# Altium project pi_breakout.PrjPCB
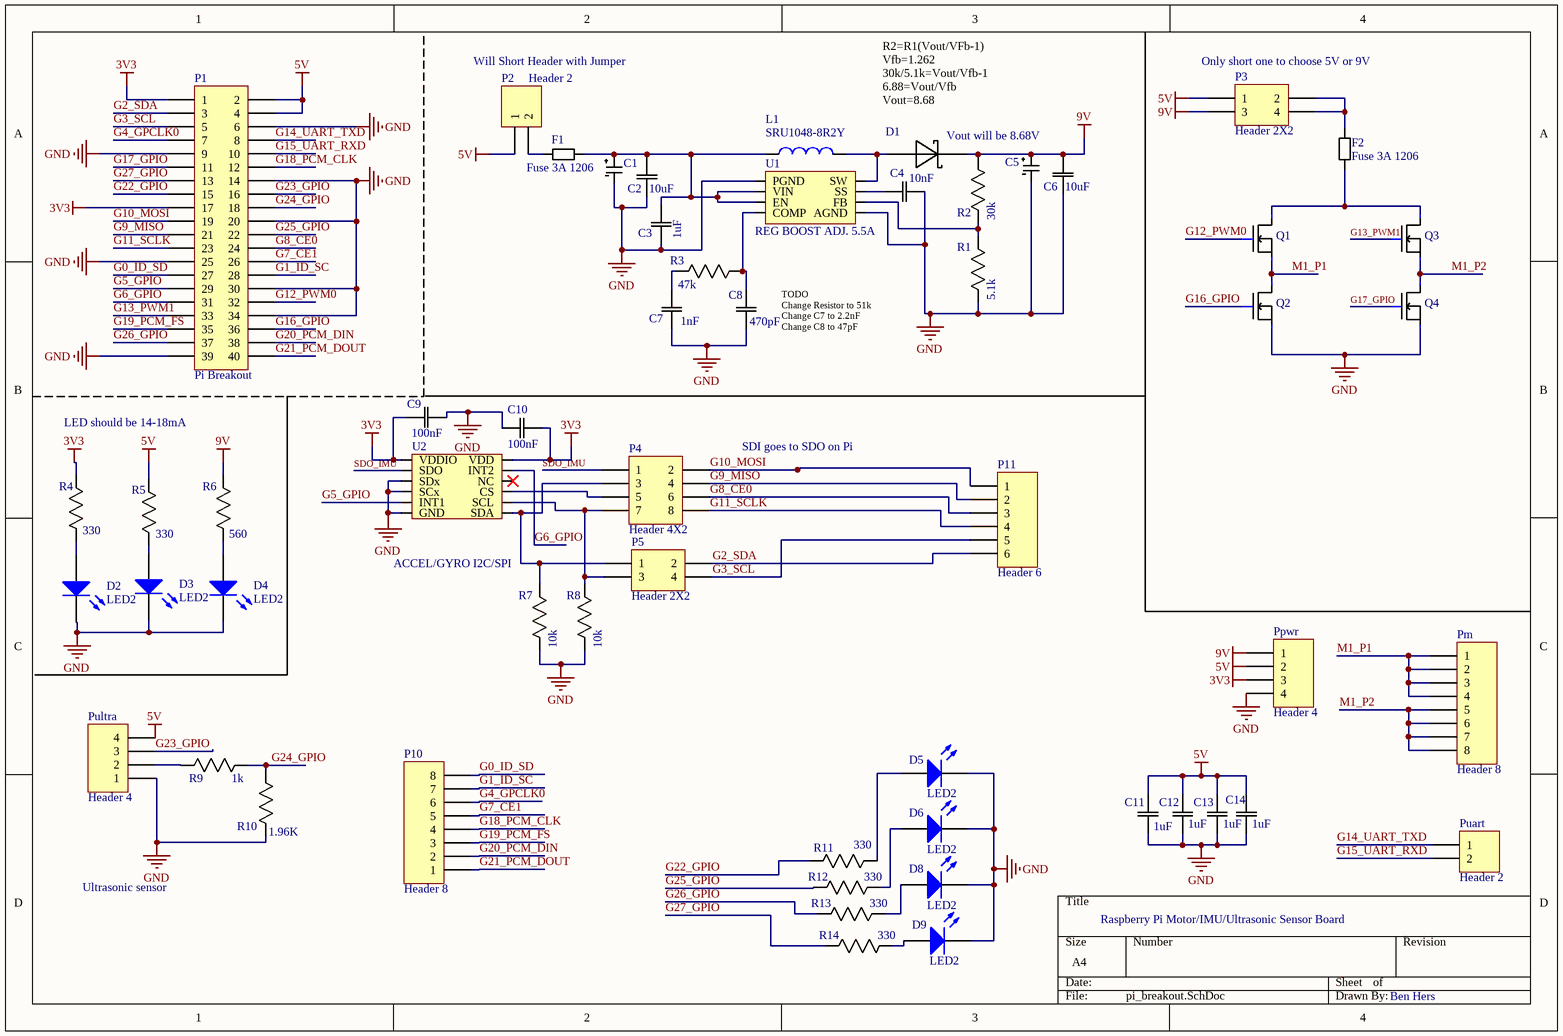
[diagram p0: pi_breakout.SchDoc]
1 sheet, 56 parts. Net scope: global (net labels, ports and power ports of the same name join across sheets).
Board file: pi_breakout.PcbDoc

## Sheet pi_breakout.SchDoc
size A4

### Parts
C1  CAP ALUM 470UF RADIAL  [Aluminum Electrolytic Capacitors Radial]  (value not drawn)
C2  10uF  [0805]
C3  1uF  [0805]
C4  10nF  [0805]
C5  CAP ALUM 470UF RADIAL  [Aluminum Electrolytic Capacitors Radial]  (value not drawn)
C6  10uF  [0805]
C7  1nF  [0805]
C8  470pF  [0805]
C9  100nF  [0805]
C10  100nF  [0805]
C11  1uF  [0805]
C12  1uF  [0805]
C13  1uF  [0805]
C14  1uF  [0805]
D1  DIODE SCHOTTKY 40V 3A SMC  [SMC]  (value not drawn)
D2  LED2  [3.2X1.6X1.1]
D3  LED2  [3.2X1.6X1.1]
D4  LED2  [3.2X1.6X1.1]
D5  LED2  [3.2X1.6X1.1]
D6  LED2  [3.2X1.6X1.1]
D8  LED2  [3.2X1.6X1.1]
D9  LED2  [3.2X1.6X1.1]
F1  Fuse 3A 1206  [1206]
F2  Fuse 3A 1206  [1206]
L1  SRU1048-8R2Y  [Inductor]
P1  Pi Breakout  [HDR2X20]
P2  Header 2  [HDR1X2]
P3  Header 2X2  [HDR2X2]
P4  Header 4X2  [HDR2X4]
P5  Header 2X2  [HDR2X2]
P10  Header 8  [HDR1X8]
P11  Header 6  [HDR1X6]
Pm  Header 8  [HDR1X8]
Ppwr  Header 4  [HDR1X4]
Puart  Header 2  [HDR1X2]
Pultra  Header 4  [HDR1X4]
Q1  N-Channel  [8-SOIC MOSFET]  (value not drawn)
Q2  N-Channel  [8-SOIC MOSFET]  (value not drawn)
Q3  N-Channel  [8-SOIC MOSFET]  (value not drawn)
Q4  N-Channel  [8-SOIC MOSFET]  (value not drawn)
R1  5.1k  [0805]
R2  30k  [0805]
R3  47k  [0805]
R4  330  [0805]
R5  330  [0805]
R6  560  [0805]
R7  10k  [0805]
R8  10k  [0805]
R9  1k  [0805]
R10  1.96K  [0805]
R11  330  [0805]
R12  330  [0805]
R13  330  [0805]
R14  330  [0805]
U1  REG BOOST ADJ. 5.5A  [ICREGBOOSTADJUSTABLE5.5A8SO]
U2  ACCEL/GYRO I2C/SPI  [IMU 14-LGA]

### Nets
3V3: C9.1(C1) C10.2(C2) P1.1 P1.17 Ppwr.3 R4.1(R1) U2.VDD U2.VDDIO
5V: C11.2(C2) C12.2(C2) C13.2(C2) C14.2(C2) P1.2 P1.4 P2.1 P3.1 Ppwr.2 Pultra.4 R5.1(R1)
9V: C5.1 C6.2(C2) D1.1(K) P3.3 Ppwr.1 R2.1(R1) R6.1(R1)
GND: C1.2 C2.1(C1) C3.1(C1) C4.2(C2) C5.2 C6.1(C1) C7.1(C1) C8.1(C1) C9.2(C2) C10.1(C1) C11.1(C1) C12.1(C1) C13.1(C1) C14.1(C1) D2.2(K) D3.2(K) D4.2(K) D5.2(K) D6.2(K) D8.2(K) D9.2(K) P1.6 P1.9 P1.14 P1.20 P1.25 P1.30 P1.34 P1.39 Ppwr.4 Pultra.1 Q2.S Q4.S R1.2(R2) R7.2(R2) R8.2(R2) R10.2(R2) U1.AGND U1.PGND U2.GND U2.SCx U2.SDx
G0_ID_SD: P1.27 P10.8
G1_ID_SC: P1.28 P10.7
G2_SDA: P1.3 P5.2 P11.6
G3_SCL: P1.5 P5.4 P11.5
G4_GPCLK0: P1.7 P10.6
G5_GPIO: P1.29 U2.INT1
G6_GPIO: P1.31 U2.INT2
G7_CE1: P1.26 P10.5
G8_CE0: P1.24 P4.6 P11.3
G9_MISO: P1.21 P4.4 P11.2
G10_MOSI: P1.19 P4.2 P11.1
G11_SCLK: P1.23 P4.8 P11.4
G12_PWM0: P1.32 Q1.G
G13_PWM1: P1.33 Q3.G
G14_UART_TXD: P1.8 Puart.1
G15_UART_RXD: P1.10 Puart.2
G16_GPIO: P1.36 Q2.G
G17_GPIO: P1.11 Q4.G
G18_PCM_CLK: P1.12 P10.4
G19_PCM_FS: P1.35 P10.3
G20_PCM_DIN: P1.38 P10.2
G21_PCM_DOUT: P1.40 P10.1
G22_GPIO: P1.15 R11.1(R1)
G23_GPIO: P1.16 Pultra.3
G24_GPIO: P1.18 R9.1(R1) R10.1(R1)
G25_GPIO: P1.22 R12.1(R1)
G26_GPIO: P1.37 R13.1(R1)
G27_GPIO: P1.13 R14.1(R1)
M1_P1: Pm.1 Pm.2 Pm.3 Pm.4 Q1.S Q2.D
M1_P2: Pm.5 Pm.6 Pm.7 Pm.8 Q3.S Q4.D
SDO_IMU: P4.1 U2.SDO
NetC1_1: C1.1 C2.2(C2) C3.2(C2) F1.2 L1.1 U1.EN U1.VIN
NetC4_1: C4.1(C1) U1.SS
NetC7_2: C7.2(C2) R3.2(R2)
NetC8_2: C8.2(C2) R3.1(R1) U1.COMP
NetD1_2: D1.2(A) L1.2 U1.SW
NetD2_1: D2.1(A) R4.2(R2)
NetD3_1: D3.1(A) R5.2(R2)
NetD4_1: D4.1(A) R6.2(R2)
NetD5_1: D5.1(A) R11.2(R2)
NetD6_1: D6.1(A) R12.2(R2)
NetD8_1: D8.1(A) R13.2(R2)
NetD9_1: D9.1(A) R14.2(R2)
NetF1_1: F1.1 P2.2
NetF2_1: F2.1 Q1.D Q3.D
NetF2_2: F2.2 P3.2 P3.4
NetP4_3: P4.3 P5.1 R7.1(R1) U2.SDA
NetP4_5: P4.5 U2.CS
NetP4_7: P4.7 P5.3 R8.1(R1) U2.SCL
NetPultra_2: Pultra.2 R9.2(R2)
NetR1_1: R1.1(R1) R2.2(R2) U1.FB

Not connected (* = marked no-connect by the designer): U2 NC*

### Notes on the sheet
- Will Short Header with Jumper
- R2=R1(Vout/VFb-1)
  Vfb=1.262
  30k/5.1k=Vout/Vfb-1
  6.88=Vout/Vfb
  Vout=8.68
- (near P3) Only short one to choose 5V or 9V
- (near D1) Vout will be 8.68V
- TODO
  Change Resistor to 51k
  Change C7 to 2.2nF
  Change C8 to 47pF
- LED should be 14-18mA
- SDI goes to SDO on Pi
- Ultrasonic sensor
- Raspberry Pi Motor/IMU/Ultrasonic Sensor Board
- Ben Hers

### Library data of the parts
C1 C5 = CAP ALUM 470UF Aluminum Electrolytic Radial: 470µF 35V Aluminum Electrolytic Capacitors Radial, Can - SMD  5000 Hrs @ 105°C; MF: Panasonic Electronic Components; MP: EEV-FK1V471Q; Tolerance: 20%; Digikey: PCE3464CT-ND; Digikey Link: https://www.digikey.ca/product-detail/en/panasonic-electronic-components/EEV-FK1V471Q/PCE3464CT-ND/396323; Price: 1.8 CAD; Package: RADIAL SMD; Value: 470uF; Rating: 35V
C2 C6 = CAP 10uF 0805: CAP CER 10UF 10V X5R 0805; MP: C0805C106K8PACTU; MF: KEMET; Tolerance: 10%; Package: 0805; Price: 0.168 CAD; Value: 10uF; Digikey: 399-4925-1-ND; Digikey Link: https://www.digikey.ca/product-detail/en/kemet/C0805C106K8PACTU/399-4925-1-ND/1090920; Rating: 10V
C3 C11-C14 = CAP 1uF 0805: CAP CER 1UF 50V X7R 0805; MP: CL21B105KBFNNNE; MF: Samsung Electro-Mechanics; Tolerance: 10%; Package: 0805; Price: 0,172 CAD; Value: 1uF; Digikey: 1276-1029-1-ND; Digikey Link: https://www.digikey.ca/product-detail/en/samsung-electro-mechanics/CL21B105KBFNNNE/1276-1029-1-ND/3889115; Rating: 50V
C4 = CAP 10nF 0805: CAP CER 10000PF 50V X7R 0805; MP: CC0805KRX7R9BB103; MF: Yageo; Tolerance: 10%; Package: 0805; Price: 0,1 CAD; Value: 10nF; Digikey: 311-1136-1-ND; Digikey Link: https://www.digikey.ca/product-detail/en/yageo/CC0805KRX7R9BB103/311-1136-1-ND/303046; Rating: 50V
C7 = CAP 1nF 0805: CAP CER 1000PF 50V X7R 0805; MP: CC0805KRX7R9BB102; MF: Yageo; Tolerance: 10%; Package: 0805; Price: 0.1 CAD; Value: 1nF; Digikey: 311-1127-1-ND; Digikey Link: https://www.digikey.ca/products/en?keywords=311-1127-1-ND; Rating: 50V
C8 = CAP 470pF 0805: CAP CER 470PF 50V C0G/NPO 0805; MP: CC0805JRNPO9BN471; MF: Yageo; Tolerance: 5%; Package: 0805; Price: 0,135 CAD; Value: 470pF; Digikey: 311-1119-1-ND; Digikey Link: https://www.digikey.ca/products/en?keywords=311-1119-1-ND; Rating: 50V
C9 C10 = CAP 100nF 0805: CAP CER 0.1UF 50V X7R 0805; MP: CC0805KRX7R9BB104; MF: Yageo; Tolerance: 10%; Package: 0805; Price: 0,119 CAD; Value: 100nF; Digikey: 311-1140-1-ND; Digikey Link: https://www.digikey.ca/products/en?keywords=311-1140-1-ND; Rating: 50V
D1 = B340-13-F: Diode Schottky 40V 3A Surface Mount SMC; MF: Diodes Incorporated; Rating: 40V 3A; Digikey: B340-FDICT-ND; Digikey Link: https://www.digikey.ca/product-detail/en/diodes-incorporated/B340-13-F/B340-FDICT-ND/768811; MP: B340-13-F; Price: 0.52 CAD; Package: SMC
D2-D6 D8 D9 = LED GREEN SMD: Typical RED, GREEN, YELLOW, AMBER GaAs LED; MF: Lite-On Inc.; MP: LTST-C191KGKT; Rating: 2V; Digikey: 160-1446-1-ND; Digikey Link: https://www.digikey.ca/products/en?keywords=160-1446-1-ND; Package: 0603
F1 F2 = Fuse 3A 1206: FUSE 3.0A 63VAC/DC SLOW 1206; MF: Bel Fuse Inc.; MP: 0685T3000-01; Digikey: 507-1896-6-ND; Rating: 3A; Digikey Link: https://www.digikey.ca/product-detail/en/bel-fuse-inc/0685T3000-01/507-1896-6-ND/4968212
L1 = SRU1048-8R2Y: FIXED IND 8.2UH 4.6A 15 MOHM SMD; MF: Bourns Inc.; MP: SRU1048-8R2Y; Price: None; Package: Nonstandard; Value: 8.2uH; ComponentLink1Description: digikey; ComponentLink1URL: https://www.digikey.ca/en/products/detail/bourns-inc/SRU1048-8R2Y/2352912; Digikey: SRU1048-8R2YCT-ND; Digikey Link: https://www.digikey.ca/en/products/detail/bourns-inc/SRU1048-8R2Y/2352912
P1 = Header 20X2: Header, 20-Pin, Dual row; LatestRevisionDate: 17-Jul-2002; LatestRevisionNote: Re-released for DXP Platform.; Publisher: Altium Limited
P2 Puart = Header 2: Header, 2-Pin; LatestRevisionDate: 17-Jul-2002; LatestRevisionNote: Re-released for DXP Platform.; Publisher: Altium Limited
P3 P5 = Header 2X2: Header, 2-Pin, Dual row; LatestRevisionDate: 17-Jul-2002; LatestRevisionNote: Re-released for DXP Platform.; Publisher: Altium Limited
P4 = Header 4X2: Header, 4-Pin, Dual row; LatestRevisionDate: 17-Jul-2002; LatestRevisionNote: Re-released for DXP Platform.; Publisher: Altium Limited
P10 Pm = Header 8: Header, 8-Pin; LatestRevisionDate: 17-Jul-2002; LatestRevisionNote: Re-released for DXP Platform.; Publisher: Altium Limited
P11 = Header 6: Header, 6-Pin; LatestRevisionDate: 17-Jul-2002; LatestRevisionNote: Re-released for DXP Platform.; Publisher: Altium Limited
Ppwr Pultra = Header 4: Header, 4-Pin; LatestRevisionDate: 17-Jul-2002; LatestRevisionNote: Re-released for DXP Platform.; Publisher: Altium Limited
Q1-Q4 = MOSFET N Channel 8-SOIC: MOSFET N-CH 30V 18.5A 8-SOIC; MF: ON Semiconductor; MP: FDS8813NZ; Digikey: FDS8813NZCT-ND; Price: 1.727 CAD; Rating: 30V; Digikey Link: https://www.digikey.ca/product-detail/en/on-semiconductor/FDS8813NZ/FDS8813NZCT-ND/1626932; Package: 8-SOIC
R1 = RES 5.1k 0805: RES SMD 5.1K OHM 1% 1/8W 0805; MP: RC0805FR-075K1L; MF: Yageo; Rating: 0.125W; Digikey: 311-5.10KCRDKR-ND; Price: 0.061 CAD; Package: 0805; Value: 5.1k; Digikey Link: https://www.digikey.ca/products/en?keywords=311-5.10KCRDKR-ND; Tolerance: 1%
R2 = RES 30k 0805: RES SMD 30K OHM 1% 1/8W 0805; MP: RC0805FR-0730KL; MF: Yageo; Rating: 0.125W; Digikey: 311-30.0KCRDKR-ND; Price: 0.061 CAD; Package: 0805; Value: 30k; Digikey Link: https://www.digikey.ca/products/en?keywords=311-30.0KCRDKR-ND; Tolerance: 1%
R3 = RES 47k 0805: RES SMD 47K OHM 1% 1/8W 0805; MP: RC0805FR-0747KL; MF: Yageo; Rating: 0.125W; Digikey: 311-47.0KCRCT-ND; Price: 0.061 CAD; Package: 0805; Value: 47k; Digikey Link: https://www.digikey.ca/product-detail/en/yageo/RC0805FR-0747KL/311-47.0KCRCT-ND/730920; Tolerance: 1%
R4 R5 R11-R14 = RES 330 0805: RES SMD 330 OHM 1% 1/8W 0805; MP: RC0805FR-07330RL; MF: Yageo; Rating: 0.125W; Digikey: 311-330CRCT-ND; Price: 0.061 CAD; Package: 0805; Value: 330; Digikey Link: https://www.digikey.ca/products/en?keywords=311-330CRCT-ND
R6 = RES 560 0805: RES 560 OHM 1% 1/8W 0805; MP: RMCF0805FT560R; MF: Stackpole Electronics Inc; Rating: 0.125W; Digikey: RMCF0805FT560RCT-ND; Price: 0.15 CAD; Package: 0805; Value: 560; Digikey Link: https://www.digikey.ca/product-detail/en/stackpole-electronics-inc/RMCF0805FT560R/RMCF0805FT560RCT-ND/2418431; Tolerance: 1%
R7 R8 = RES 10k 0805: RES SMD 10K OHM 1% 1/8W 0805; MP: RC0805FR-0710KL; MF: Yageo; Rating: 0.125W; Digikey: 311-10.0KCRCT-ND; Price: 0.061 CAD; Package: 0805; Value: 10k; Digikey Link: https://www.digikey.ca/products/en?keywords=311-10.0KCRCT-ND; Tolerance: 1%
R9 = RES 1k 0805: RES SMD 1K OHM 5% 1/8W 0805; MP: RC0805JR-071KL; MF: Yageo; Rating: 0.125W; Digikey: 311-1.0KARCT-ND; Price: 0.048 CAD; Package: 0805; Value: 1k; Digikey Link: https://www.digikey.ca/products/en?keywords=311-1.0KARCT-ND; Tolerance: 5%
R10 = RES 1.96k 0805: RES SMD 1.96K OHM 1% 1/8W 0805; MP: ERJ-6ENF1961V; MF: Panasonic Electronic Components; Rating: 0.125W; Digikey: P1.96KCCT-ND; Price: 0.15 CAD; Package: 0805; Value: 1.96k; Digikey Link: https://www.digikey.ca/product-detail/en/panasonic-electronic-components/ERJ-6ENF1961V/P1.96KCCT-ND/119041; Tolerance: 1%
U1 = REG BOOST ADJUSTABLE 5.5A 8SO: Boost Switching Regulator IC Positive Adjustable 2.7V 1 Output 5.5A (Switch) 8-SOIC (0.154", 3.90mm Width) Exposed Pad; MF: Diodes Incorporated; MP: PAM2423AECADJR; Digikey: PAM2423AECADJRDICT-ND; Digikey Link: https://www.digikey.ca/product-detail/en/diodes-incorporated/PAM2423AECADJR/PAM2423AECADJRDICT-ND/4505224; Price: 1.68 CAD; Package: 8SOIC
U2 = IMU 14LGA: Accelerometer, Gyroscope, Temperature, 6 Axis Sensor I²C, SPI Output; MP: LSM6DSLTR; MF: STMicroelectronics; Digikey: 497-16705-1-ND; Digikey Link: https://www.digikey.ca/product-detail/en/stmicroelectronics/LSM6DSLTR/497-16705-1-ND/6192805; Price: 5.407 CAD; Package: 14-LGA; Value: N/A; Rating: N/A; Tolerance: N/A